# EAGLE schematic CC2541_Breakout_Board (EAGLE 6.1)
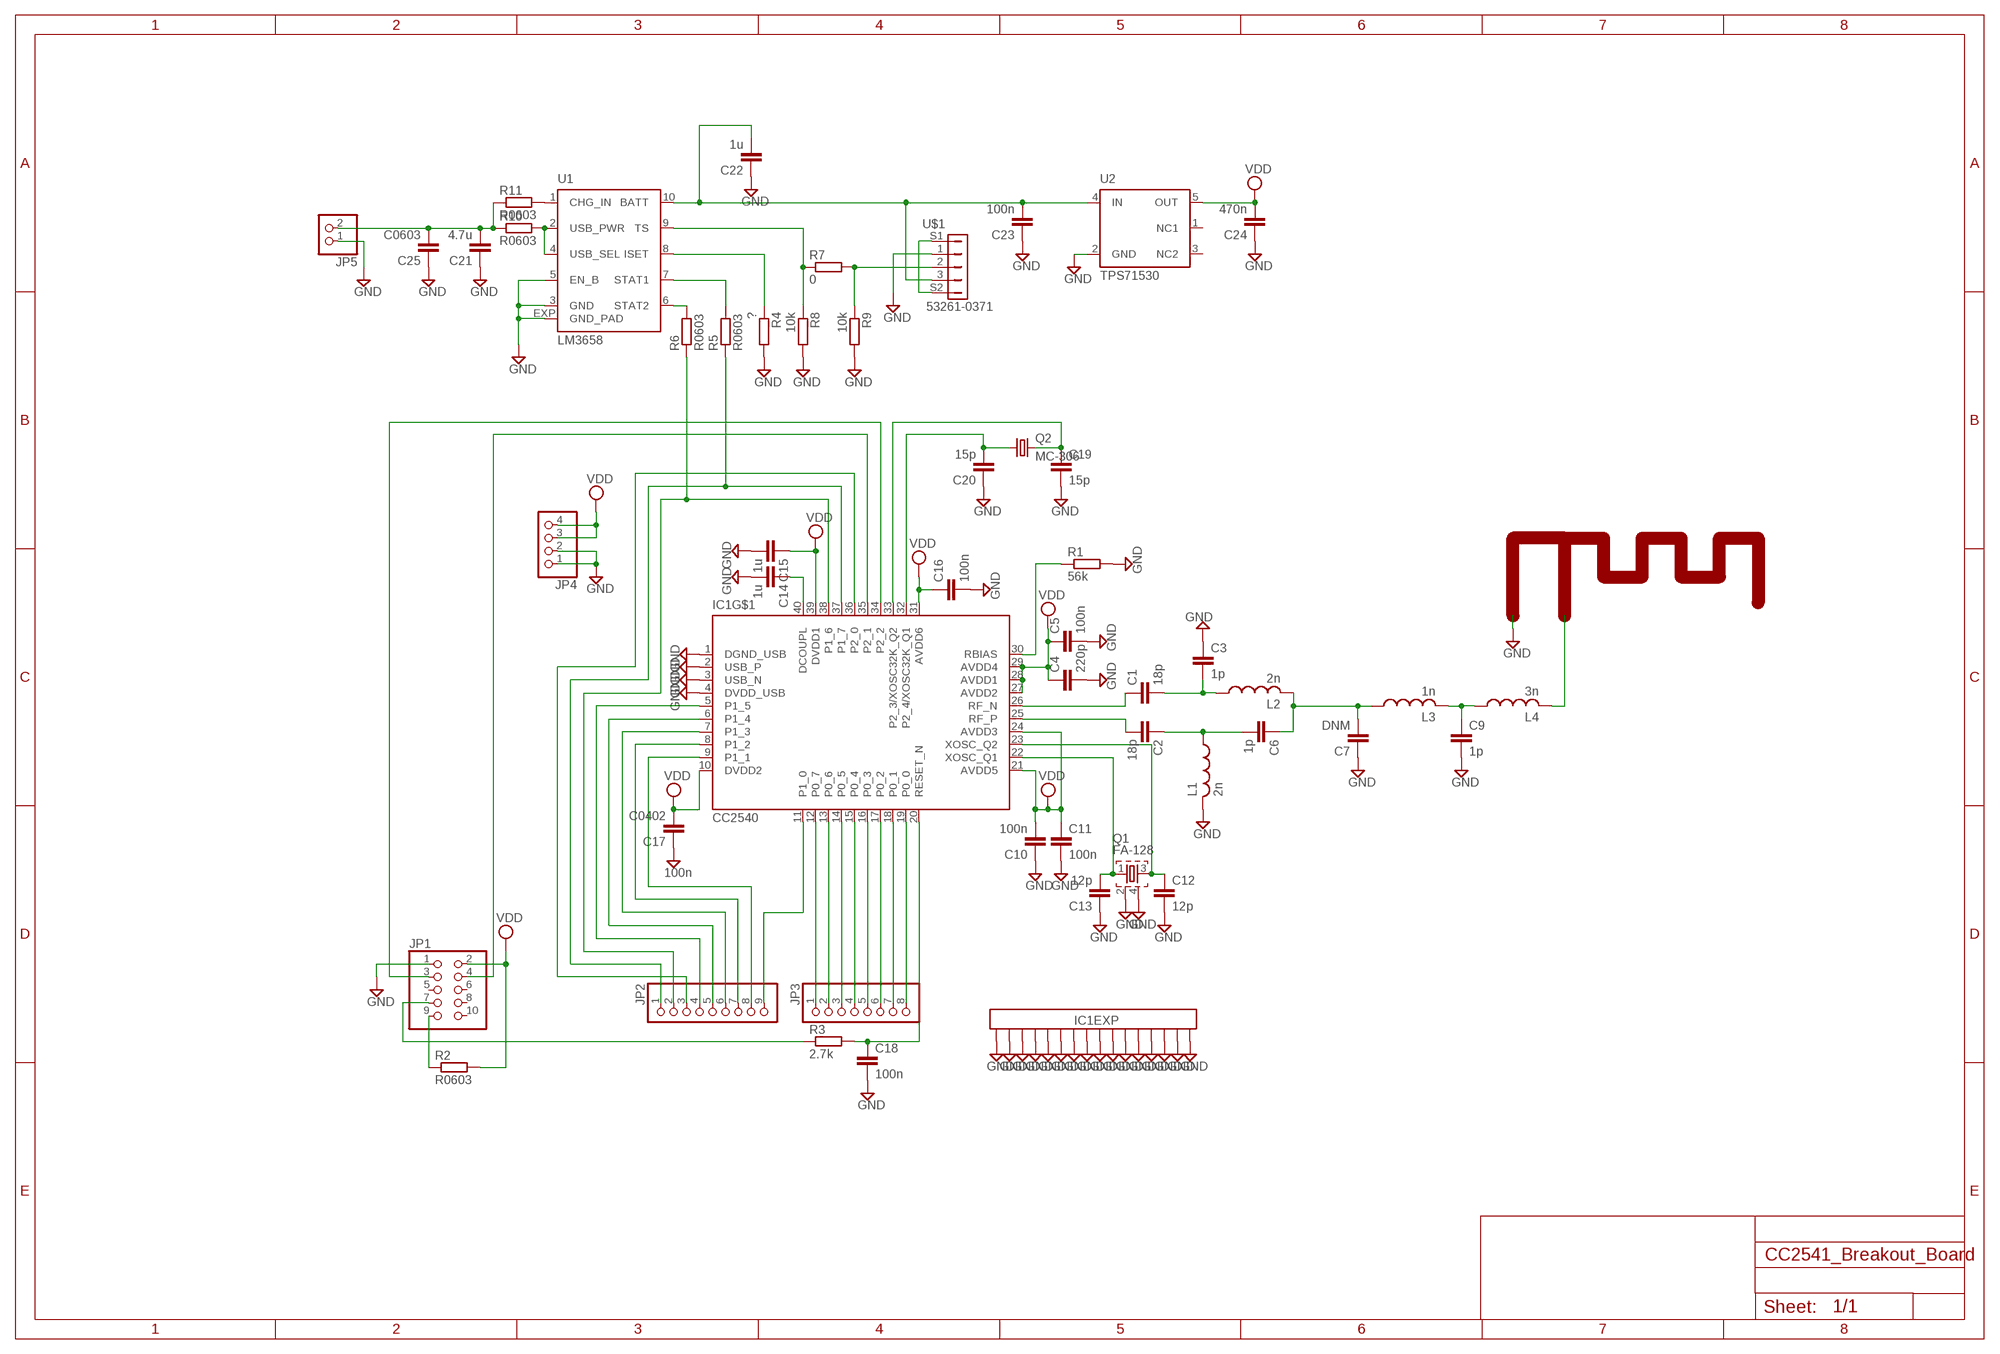
[diagram p0: schematic, sheet 1]

## Parts
A1  TI_2.4GHZ_MIFALEFT  [TI_2.4GHZ_MIFA_LEFT]
C1  18p  C0402  [C0402]
C2  18p  C0402  [C0402]
C3  1p  C0402  [C0402]
C4  220p  C0402  [C0402]
C5  100n  C0402  [C0402]
C6  1p  C0402  [C0402]
C7  DNM  C0402  [C0402]
C9  1p  C0402  [C0402]
C10  100n  C0402  [C0402]
C11  100n  C0402  [C0402]
C12  12p  C0402  [C0402]
C13  12p  C0402  [C0402]
C14  1u  C0402  [C0402]
C15  1u  C0402  [C0402]
C16  100n  C0402  [C0402]
C17  C0402  [C0402]
C18  100n  C0402  [C0402]
C19  15p  C0402  [C0402]
C20  15p  C0402  [C0402]
C21  4.7u  C0402  [C0402]
C22  1u  C0402  [C0402]
C23  100n  C0402  [C0402]
C24  470n  C0402  [C0402]
C25  C0603  [C0603]
IC1  CC2540  [QFN40-6X6]
JP1  PINHD-2X51.27_SMD  [2X05_1.27_SMD]
JP2  PINHD-1X9  [1X09]
JP3  PINHD-1X8  [1X08]
JP4  PINHD-1X4  [1X04]
JP5  PINHD-1X2  [1X02]
L1  2n  L0402  [C0402]
L2  2n  L0402  [C0402]
L3  1n  L0402  [C0402]
L4  3n  L0402  [C0402]
Q1  FA-128  [FA-128]
Q2  MC-306  [MC-306]
R1  56k  R0402  [C0402]
R2  R0603  [C0603]
R3  2.7k  R0402  [C0402]
R4  ?  R0402  [C0402]
R5  R0603  [C0603]
R6  R0603  [C0603]
R7  0  R0402  [C0402]
R8  10k  R0402  [C0402]
R9  10k  R0402  [C0402]
R10  R0603  [C0603]
R11  R0603  [C0603]
U1  LM3658  [LLP10]
U2  TPS71530  [SC70]
U$1  53261-0371  [53261-03]

## Nets
CONNECTOR_MOUNT: U$1.S1 U$1.S2
GND: A1.GND C3.1 C4.2 C5.2 C7.1 C9.2 C10.1 C11.2 C12.2 C13.1 C14.2 C15.2 C16.2 C17.1 C18.2 C19.2 C20.1 C21.1 C22.1 C23.1 C24.1 C25.1 IC1.1(DGND_USB) IC1.2(USB_P) IC1.3(USB_N) IC1.4(DVDD_USB) IC1.EXP@1(EXP:EXP16) IC1.EXP@2(EXP:EXP16) IC1.EXP@3(EXP:EXP16) IC1.EXP@4(EXP:EXP16) IC1.EXP@5(EXP:EXP16) IC1.EXP@6(EXP:EXP16) IC1.EXP@7(EXP:EXP16) IC1.EXP@8(EXP:EXP16) IC1.EXP@9(EXP:EXP16) IC1.EXP@10(EXP:EXP16) IC1.EXP@11(EXP:EXP16) IC1.EXP@12(EXP:EXP16) IC1.EXP@13(EXP:EXP16) IC1.EXP@14(EXP:EXP16) IC1.EXP@15(EXP:EXP16) IC1.EXP@16(EXP:EXP16) JP1.1 JP4.1 JP4.2 JP5.1 L1.2 Q1.2 Q1.4 R1.2 R4.2 R8.2 R9.2 U1.3(GND) U1.5(EN_B) U1.EXP(GND_PAD) U2.2(GND) U$1.1 ; supply symbol labelled 100n
N$1: C1.1 IC1.26(RF_N)
N$2: C2.2 IC1.25(RF_P)
N$3: C1.2 C3.2 L2.1
N$4: C2.1 C6.2 L1.1
N$5: C6.1 C7.2 L2.2 L3.1
N$6: C9.1 L3.2 L4.1
N$7: IC1.30(RBIAS) R1.1
N$8: C13.2 IC1.22(XOSC_Q1) Q1.1
N$9: C12.1 IC1.23(XOSC_Q2) Q1.3
N$10: C14.1 IC1.40(DCOUPL)
N$11: JP1.7 R3.1
N$12: JP1.9 R2.1
N$13: IC1.34(P2_2) JP1.3
N$14: IC1.35(P2_1) JP1.4
N$15: C18.1 IC1.20(RESET_N) R3.2
N$16: C20.2 IC1.32(P2_4/XOSC32K_Q1) Q2.1
N$17: C19.1 IC1.33(P2_3/XOSC32K_Q2) Q2.4
N$18: IC1.19(P0_0) JP3.8
N$19: IC1.18(P0_1) JP3.7
N$20: IC1.17(P0_2) JP3.6
N$21: IC1.16(P0_3) JP3.5
N$22: IC1.15(P0_4) JP3.4
N$23: IC1.14(P0_5) JP3.3
N$24: IC1.13(P0_6) JP3.2
N$25: IC1.12(P0_7) JP3.1
N$26: IC1.11(P1_0) JP2.9
N$27: IC1.9(P1_1) JP2.8
N$28: IC1.7(P1_3) JP2.6
N$29: IC1.8(P1_2) JP2.7
N$30: R10.2 U1.2(USB_PWR) U1.4(USB_SEL)
N$31: IC1.6(P1_4) JP2.5
N$32: IC1.38(P1_6) JP2.2 R6.1
N$33: IC1.37(P1_7) JP2.1 R5.1
N$34: R4.1 U1.8(ISET)
N$35: C21.2 C25.2 JP5.2 R10.1 R11.1
N$36: C22.2 C23.2 U1.10(BATT) U2.4(IN) U$1.3
N$37: R5.2 U1.7(STAT1)
N$38: R6.2 U1.6(STAT2)
N$39: IC1.36(P2_0) JP2.3
N$40: R7.2 R9.1 U$1.2
N$41: R7.1 R8.1 U1.9(TS)
N$42: IC1.5(P1_5) JP2.4
N$43: R11.2 U1.1(CHG_IN)
N$44: A1.FEED L4.2
VDD: C4.1 C5.1 C10.2 C11.1 C15.1 C16.1 C17.2 C24.2 IC1.10(DVDD2) IC1.21(AVDD5) IC1.24(AVDD3) IC1.27(AVDD2) IC1.28(AVDD1) IC1.29(AVDD4) IC1.31(AVDD6) IC1.39(DVDD1) JP1.2 JP4.3 JP4.4 R2.2 U2.5(OUT)
Unconnected: JP1.5 JP1.6 JP1.8 JP1.10 U2.1(NC1)

## Power pins joined to a net without a drawn wire
NC2: U2.3(NC2)

## Library data of the parts
A1 = antennas:TI_2.4GHZ_MIFA
C1-C7 C9-C24 = smd-ipc:C0402
C25 = smd-ipc:C0603
IC1 = texas:CC2540: 2.4-GHz Bluetooth® low energy System-on-Chip Auto generated by make-symbol-device-package-bsdl.ulp Rev. 39 Source: cc2540.txt
JP1 = pinhead:PINHD-2X5: PIN HEADER
JP2 = pinhead:PINHD-1X9: PIN HEADER
JP3 = pinhead:PINHD-1X8: PIN HEADER
JP4 = pinhead:PINHD-1X4: PIN HEADER
JP5 = pinhead:PINHD-1X2: PIN HEADER
L1-L4 = smd-ipc:L0402
Q1 = crystal:FA-: MHz RANGE CRYSTAL UNIT Source: Epson Toyocom
Q2 = crystal:MC-306: kHz RANGE CRYSTAL UNIT SMD Source: MC-306_405_406_E07X.PDF Homepage <http://www.epsontoyocom.co.jp>; MPN: MC-306 60.0KHZ 100PPM ,12.5PF; OC_FARNELL: 1278040; OC_NEWARK: 31M5576
R1 R3 R4 R7-R9 = smd-ipc:R0402
R2 R5 R6 R10 R11 = smd-ipc:R0603
U1 = national-semiconductor:LM3658
U2 = texas:TPS71530
U$1 = con-molex:53261-0371